# Altium project PULSE COUNTER.PrjPCB
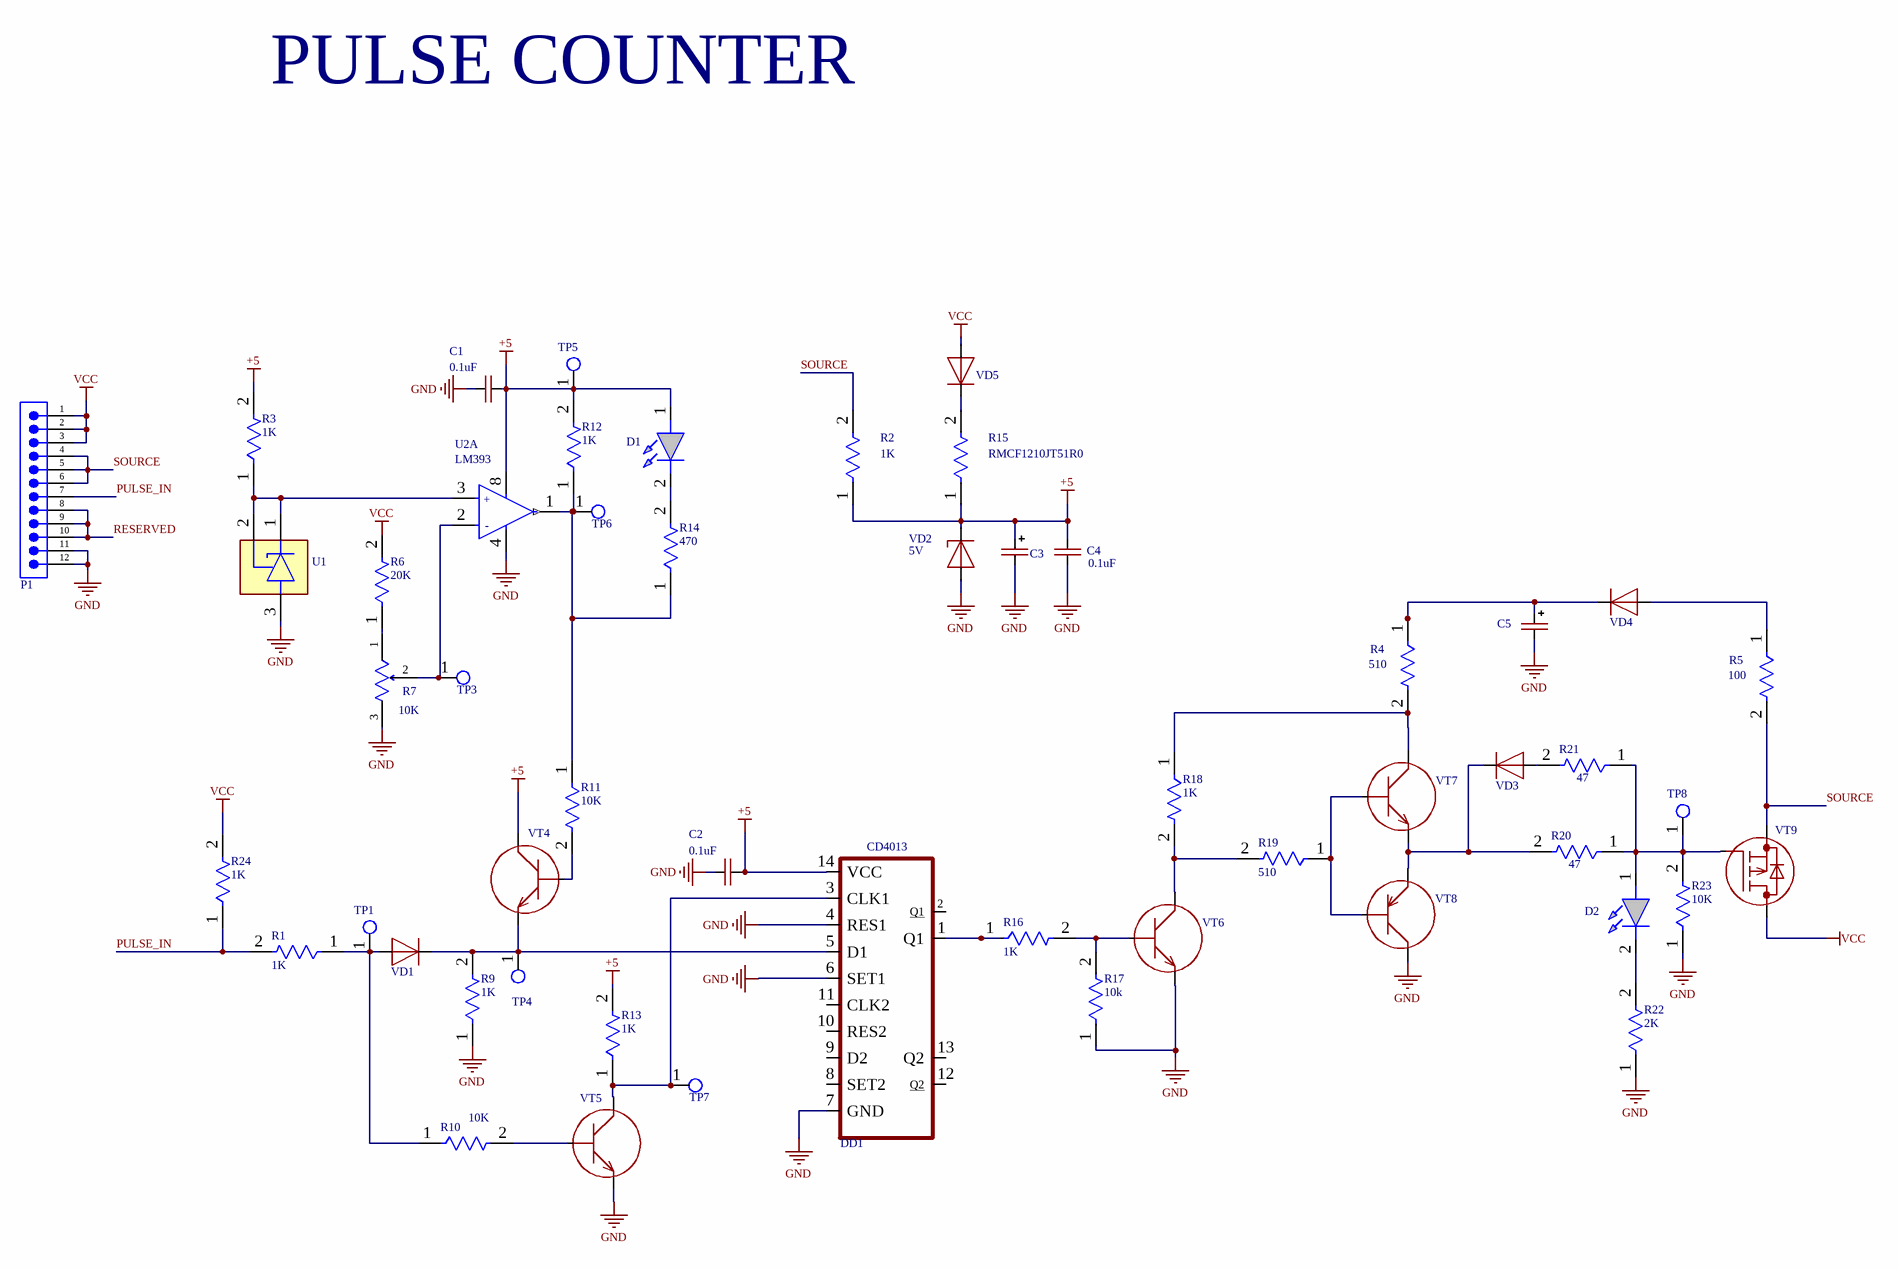
[diagram p0: PULSE COUNTER.SchDoc]
1 sheet, 52 parts. Net scope: global (net labels, ports and power ports of the same name join across sheets).
Board file: PULSE COUNTER.PcbDoc

## Sheet PULSE COUNTER.SchDoc
size A1; SPICEModelCacheYQEDCYZF: <root> / <DocumentId>YQEDCYZF</DocumentId> / </root>

### Parts
C1  0.1uF  [CAP-0805]
C2  0.1uF  [CAP-0805]
C3  CAP-POLAR  [CAP-TAN-D]  (value not drawn)
C4  0.1uF  [CAP-0805]
C5  CAP-POLAR  [SIZE_EEE]  (value not drawn)
D1  151031YS06000  [LED_RED]  (value not drawn)
D2  151031YS06000  [LED_RED]  (value not drawn)
DD1  CD4013  [SO14-150]
P1  61301211021  [61301211021]  (value not drawn)
R1  1K  [RES-0805]
R2  1K  [FP-RMCF1210-MFG]
R3  1K  [RES-0805]
R4  510  [RES-0805]
R5  100  [RES-0805]
R6  20K  [RES-0805]
R7  10K  [RES_Adj_3296W_Bourns]
R9  1K  [RES-0805]
R10  10K  [RES-0805]
R11  10K  [RES-0805]
R12  1K  [RES-0805]
R13  1K  [RES-0805]
R14  470  [RES-0805]
R15  RMCF1210JT51R0  [FP-RMCF1210-MFG]
R16  1K  [RES-0805]
R17  10k  [RES-0805]
R18  1K  [RES-0805]
R19  510  [RES-0805]
R20  47  [RES-0805]
R21  47  [RES-0805]
R22  2K  [RES-0805]
R23  10K  [RES-0805]
R24  1K  [RES-0805]
TP1  (no value)  [Test_Point]
TP3  (no value)  [Test_Point]
TP4  (no value)  [Test_Point]
TP5  (no value)  [Test_Point]
TP6  (no value)  [Test_Point]
TP7  (no value)  [Test_Point]
TP8  (no value)  [Test_Point]
U1  TL431  [TL431_SOT-23-3(A)]  (value not drawn)
U2  LM393  [FP-751-07-IPC_C]  (part A of 2)
VD1  DIODE  [DO-214AC, SMA]  (value not drawn)
VD2  5V  [DO-017AA]
VD3  DIODE  [DO-214AC, SMA]  (value not drawn)
VD4  DIODE  [DO-214AC, SMA]  (value not drawn)
VD5  DIODE  [DO-214AC, SMA]  (value not drawn)
VT4  BC847-BEC  [SOT23-3]  (value not drawn)
VT5  BC847-BEC  [SOT23-3]  (value not drawn)
VT6  BC847-BEC  [SOT23-3]  (value not drawn)
VT7  BC847-BEC  [SOT23-3]  (value not drawn)
VT8  BC857-BEC  [SOT23-3]  (value not drawn)
VT9  MOSFET-P-CH-DPAK  [DPAK]  (value not drawn)

### Nets
+5: C1.2 C2.2 C3.1(+) C4.2 D1.1(A) DD1.14(VCC) R2.1 R3.2 R12.2 R13.2 R15.1 TP5.1(G9) U2.8(VCC) VD2.1(C) VT4.3(C)
GND: C1.1 C2.1 C3.2(-) C4.1 C5.2(-) DD1.4(RES1) DD1.6(SET1) DD1.7(GND) P1.11 P1.12 R7.3(CW) R9.1 R17.1 R22.1 R23.1 U1.3(A) U2.4(VEE/GND) VD2.2(A) VT5.2(E) VT6.2(E) VT8.3(C)
VCC: P1.1 P1.2 P1.3 R6.2 R24.2 VD5.2(A) VT9.4(D)
PULSE_IN: P1.7 R1.2 R24.1
RESERVED: P1.8 P1.9 P1.10
SOURCE: P1.4 P1.5 P1.6 R2.2 R5.2 VT9.3(S)
NetC5_1: C5.1(+) R4.1 VD4.1(C)
NetD1_2: D1.2(K) R14.2
NetD2_1: D2.1(A) R20.1 R21.1 R23.2 TP8.1(G9) VT9.1(G)
NetD2_2: D2.2(K) R22.2
NetDD1_1: DD1.1(Q1) R16.1
NetDD1_3: DD1.3(CLK1) R13.1 TP7.1(G9) VT5.3(C)
NetDD1_5: DD1.5(D1) R9.2 TP4.1(G9) VD1.1(C) VT4.2(E)
NetR1_1: R1.1 R10.1 TP1.1(G9) VD1.2(A)
NetR3_1: R3.1 U1.1(C) U1.2(REF) U2.3(INPUT_A+)
NetR4_2: R4.2 R18.1 VT7.3(C)
NetR5_1: R5.1 VD4.2(A)
NetR6_1: R6.1 R7.1(CCW)
NetR7_2: R7.2(WIPER) TP3.1(G9) U2.2(INPUT_A-)
NetR10_2: R10.2 VT5.1(B)
NetR11_1: R11.1 R12.1 R14.1 TP6.1(G9) U2.1(OUTPUT_A)
NetR11_2: R11.2 VT4.1(B)
NetR15_2: R15.2 VD5.1(C)
NetR16_2: R16.2 R17.2 VT6.1(B)
NetR18_2: R18.2 R19.2 VT6.3(C)
NetR19_1: R19.1 VT7.1(B) VT8.1(B)
NetR20_2: R20.2 VD3.1(C) VT7.2(E) VT8.2(E)
NetR21_2: R21.2 VD3.2(A)

Not connected (* = marked no-connect by the designer): DD1 2(Q1) 8(SET2) 9(D2) 10(RES2) 11(CLK2) 12(Q2) 13(Q2)

### Notes on the sheet
- PULSE COUNTER
- (in symbol CMP-1310-00291-2, part A) +; -

### Library data of the parts
C1 C2 C4 = CAP-NON-POLAR
D1 D2 = LED: WURTH ELEKTRONIK - 151031YS06000 - LED, Yellow, Through Hole, T-1 (3mm), 30 mA, 2 V, 590 nm; Geometry.Height: 5.5mm; Manufacturer_Name: Wurth Elektronik; Manufacturer_Part_Number: 151031YS06000; Mouser Part Number: 710-151031YS06000; Mouser Price/Stock: https://www.mouser.co.uk/ProductDetail/Wurth-Elektronik/151031YS06000?qs=LlUlMxKIyB3xSYYW%252BcuBiQ%3D%3D; Arrow Part Number: *; Arrow Price/Stock: *; Mouser Testing Part Number: *; Mouser Testing Price/Stock: *; Datasheet Link: https://katalog.we-online.de/led/datasheet/151031YS06000.pdf
P1 = 61301211021: WR-PHD Pin Header, THT, Angled, pitch 2.54mm, 1 Row, 12P; Manufacturer: Wurth Elektronik; Contact Resistance: 20mΩ; Rated Current: 3A; Working Voltage: 250V; Withstanding Voltage: 500V; ComponentLink1Description: Website Link; ComponentLink1URL: https://www.we-online.com/redexpert/article/61301211021?ad; ComponentLink2Description: Datasheet Link; ComponentLink2URL: https://www.we-online.com/redexpert/spec/61301211021?ad; Manufacturer Part Number: 61301211021; Category: Board-to-Board Connectors; Match Code: WR-PHD; Mount: Through Hole; Operating Temperature Max: 105°C; Operating Temperature Min: -40°C; Packaging: Bag; Gender: Pin Header; Number of Pins: 12; Number of Rows: 1; Orientation: Angled; Pitch: 2.54mm
R1 R3 R4 R6 R9-R13 R17 R19 R22-R24 = RES-CONST
R2 = CMP-26527-006785-1: Temperature Coefficient: 200ppm/°C; Resistance: 51R; Max Power Dissipation: 500mW; Tolerance: 5%; Case Code (Metric): 3225; Height: 0.028inch; Mount: Surface Mount; Max Operating Temperature: 155°C; Min Operating Temperature: -55°C; Length: 0.126inch; Features: Automotive AEC-Q200; Number of Terminations: 2; Width: 0.098inch; Case Code (Imperial): 1210; Packaging: Tape and Reel; Series: RMCF; Radiation Hardening: No; Contact Plating: Tin; RoHS Compliant: Yes; Case/Package: 1210; Lead Free: Lead Free; Resistor Type: Thick Film
R5 = RES-CONST: 510
R7 = RES_Adj
R14 = RES-CONST: 1K
R15 = CMP-26527-006785-1: 51Ω ±5% 0.5W 1210 Thick Film Chip Resistor AEC-Q200 compliant; Temperature Coefficient: 200ppm/°C; Resistance: 51R; Max Power Dissipation: 500mW; Case Code (Metric): 3225; Height: 0.028inch; Mount: Surface Mount; Max Operating Temperature: 155°C; Min Operating Temperature: -55°C; Length: 0.126inch; Features: Automotive AEC-Q200; Number of Terminations: 2; Width: 0.098inch; Case Code (Imperial): 1210; Packaging: Tape and Reel; Series: RMCF; Tolerance: 5%; Radiation Hardening: No; Contact Plating: Tin; RoHS Compliant: Yes; Case/Package: 1210; Lead Free: Lead Free; Resistor Type: Thick Film
R16 R18 R20 R21 = RES-CONST: 10K
TP1 TP3-TP8 = TP_PCB?: Test_Point
U1 = TL431_SOT-23-3
U2 = CMP-1310-00291-2: IC OPAMP GP 2 CIRCUIT 8SOIC; Gain Bandwidth Product: 1MHz; Number of Circuits: 2; Min Supply Voltage: 3V; Slew Rate: 0.6V/µs; Max Dual Supply Voltage: 16V; Common Mode Rejection Ratio: 65dB; Input Bias Current: 250nA; Min Dual Supply Voltage: 1.5V; Dual Supply Voltage: 9V; Operating Supply Current: 1.5mA; Output Current: 40mA; Input Offset Voltage (Vos): 7mV; Nominal Supply Current: 1.2mA; Voltage Gain: 100dB; Max Supply Voltage: 32V; Width: 4mm; Number of Pins: 8; Min Operating Temperature: 0°C; REACH SVHC: No SVHC; Contact Plating: Tin; Lead Free: Lead Free; Halogen Free: Halogen Free; Power Supply Rejection Ratio (PSRR): 65dB; Operating Supply Voltage: 16V; Package Quantity: 2500; Max Operating Temperature: 70°C; Case/Package: SOIC; Height: 1.5mm; Packaging: Tape and Reel; Radiation Hardening: No; Number of Channels: 2; Bandwidth: 1MHz; Length: 5mm; Number of Elements: 2; Number of Amplifiers: 2; Output Current per Channel: 40mA
VD2 = ZENER